# Altium schematic sheet CONNECTOR_INTERFACE.SchDoc
size 420 x 297 mm; SheetNumber: 5; SheetTotal: 23
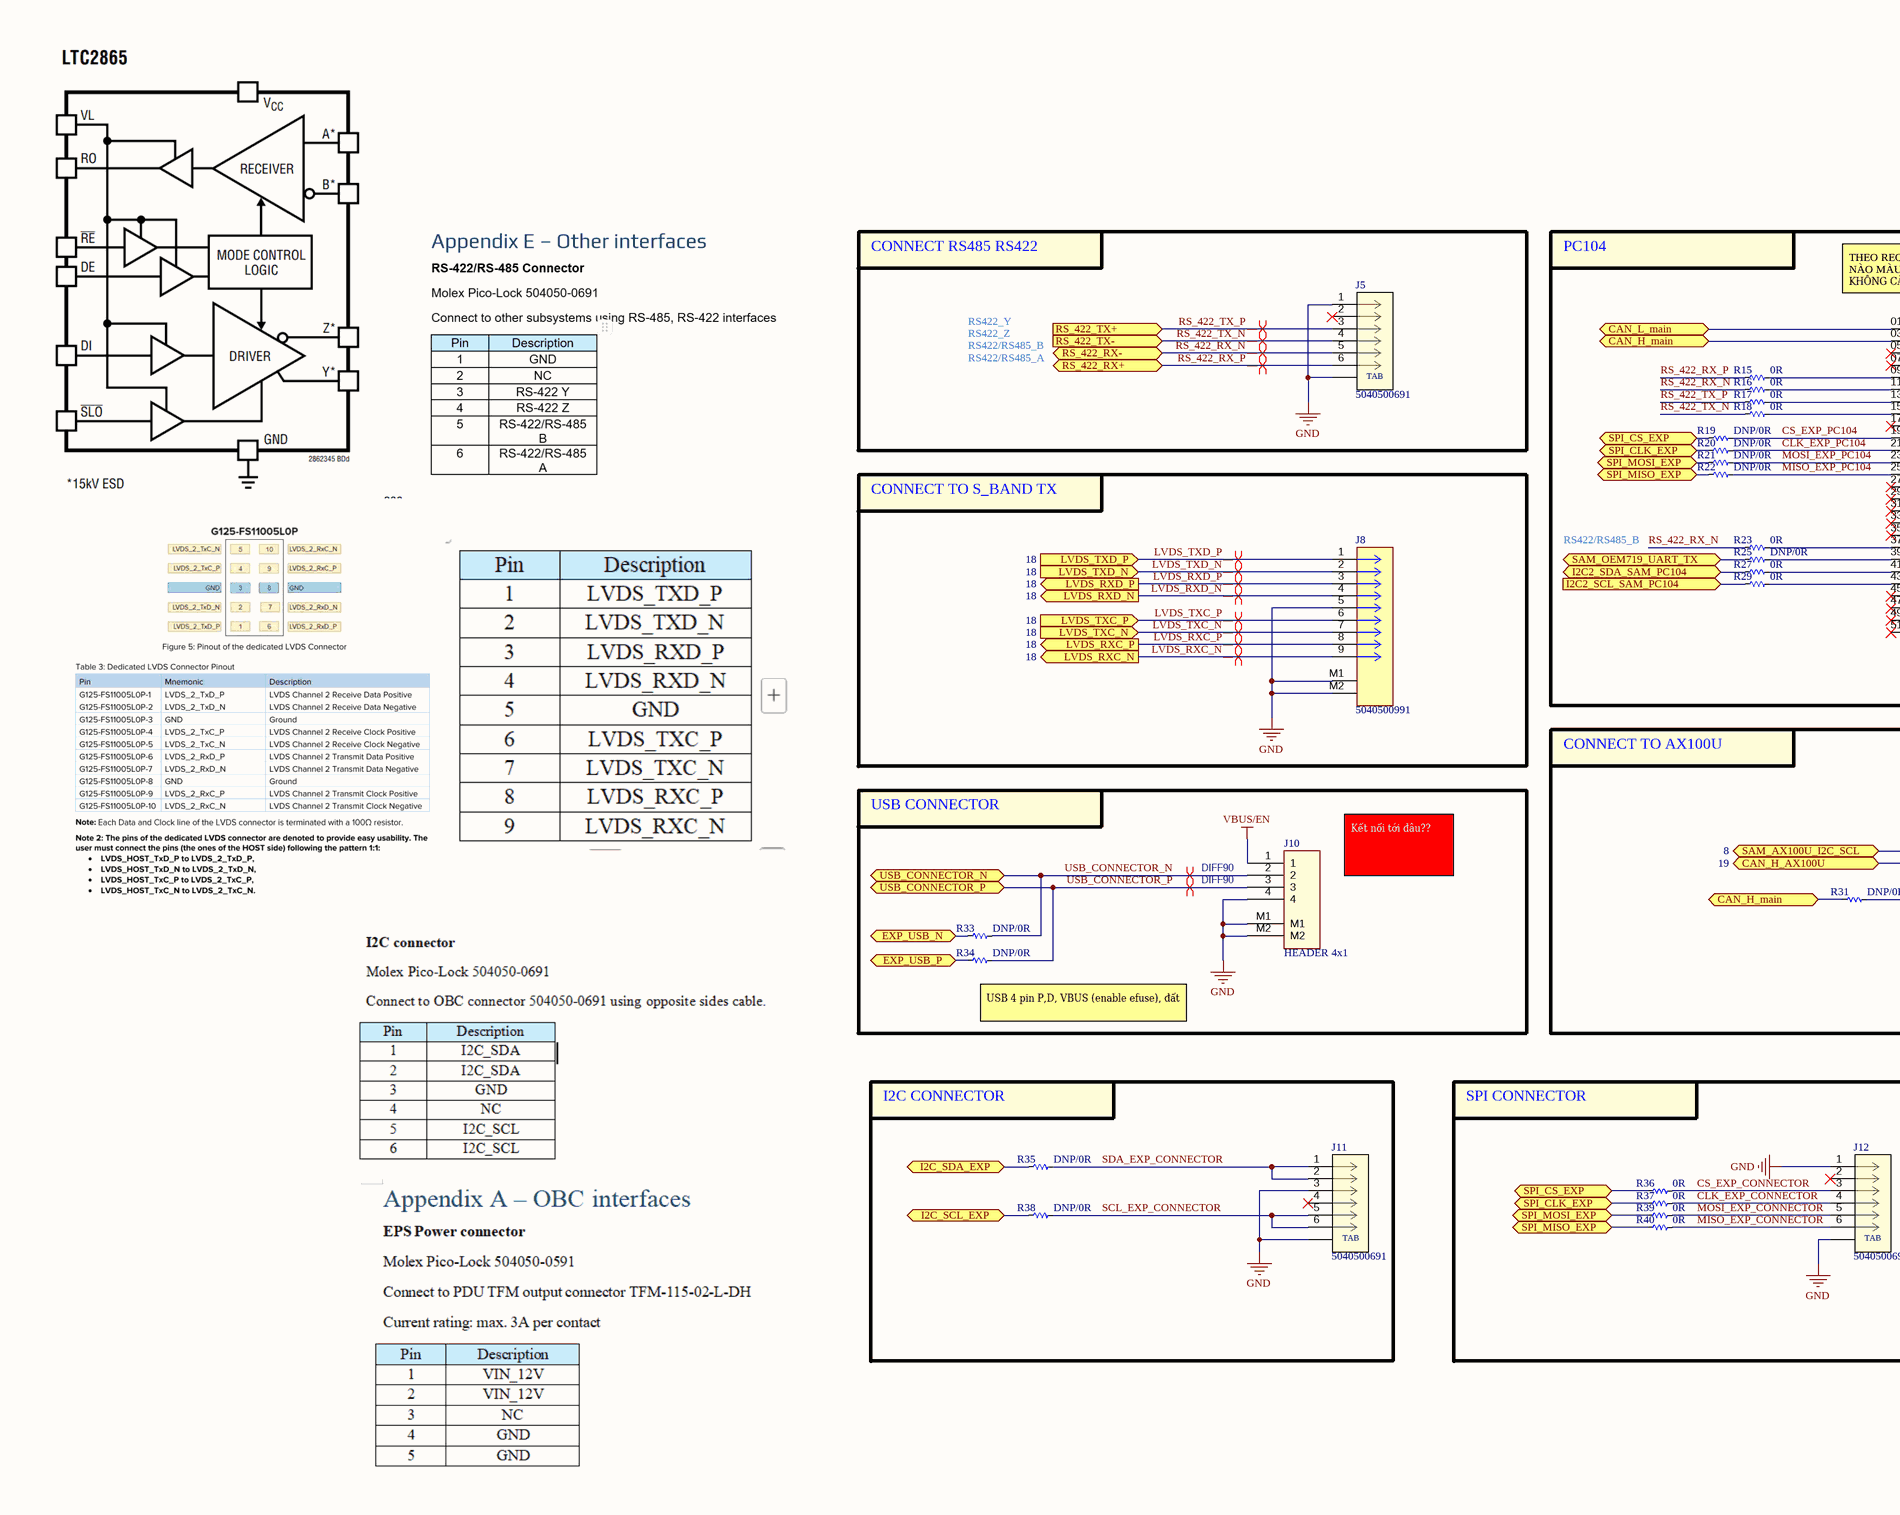
[diagram p0: CONNECTOR_INTERFACE.SchDoc, left]
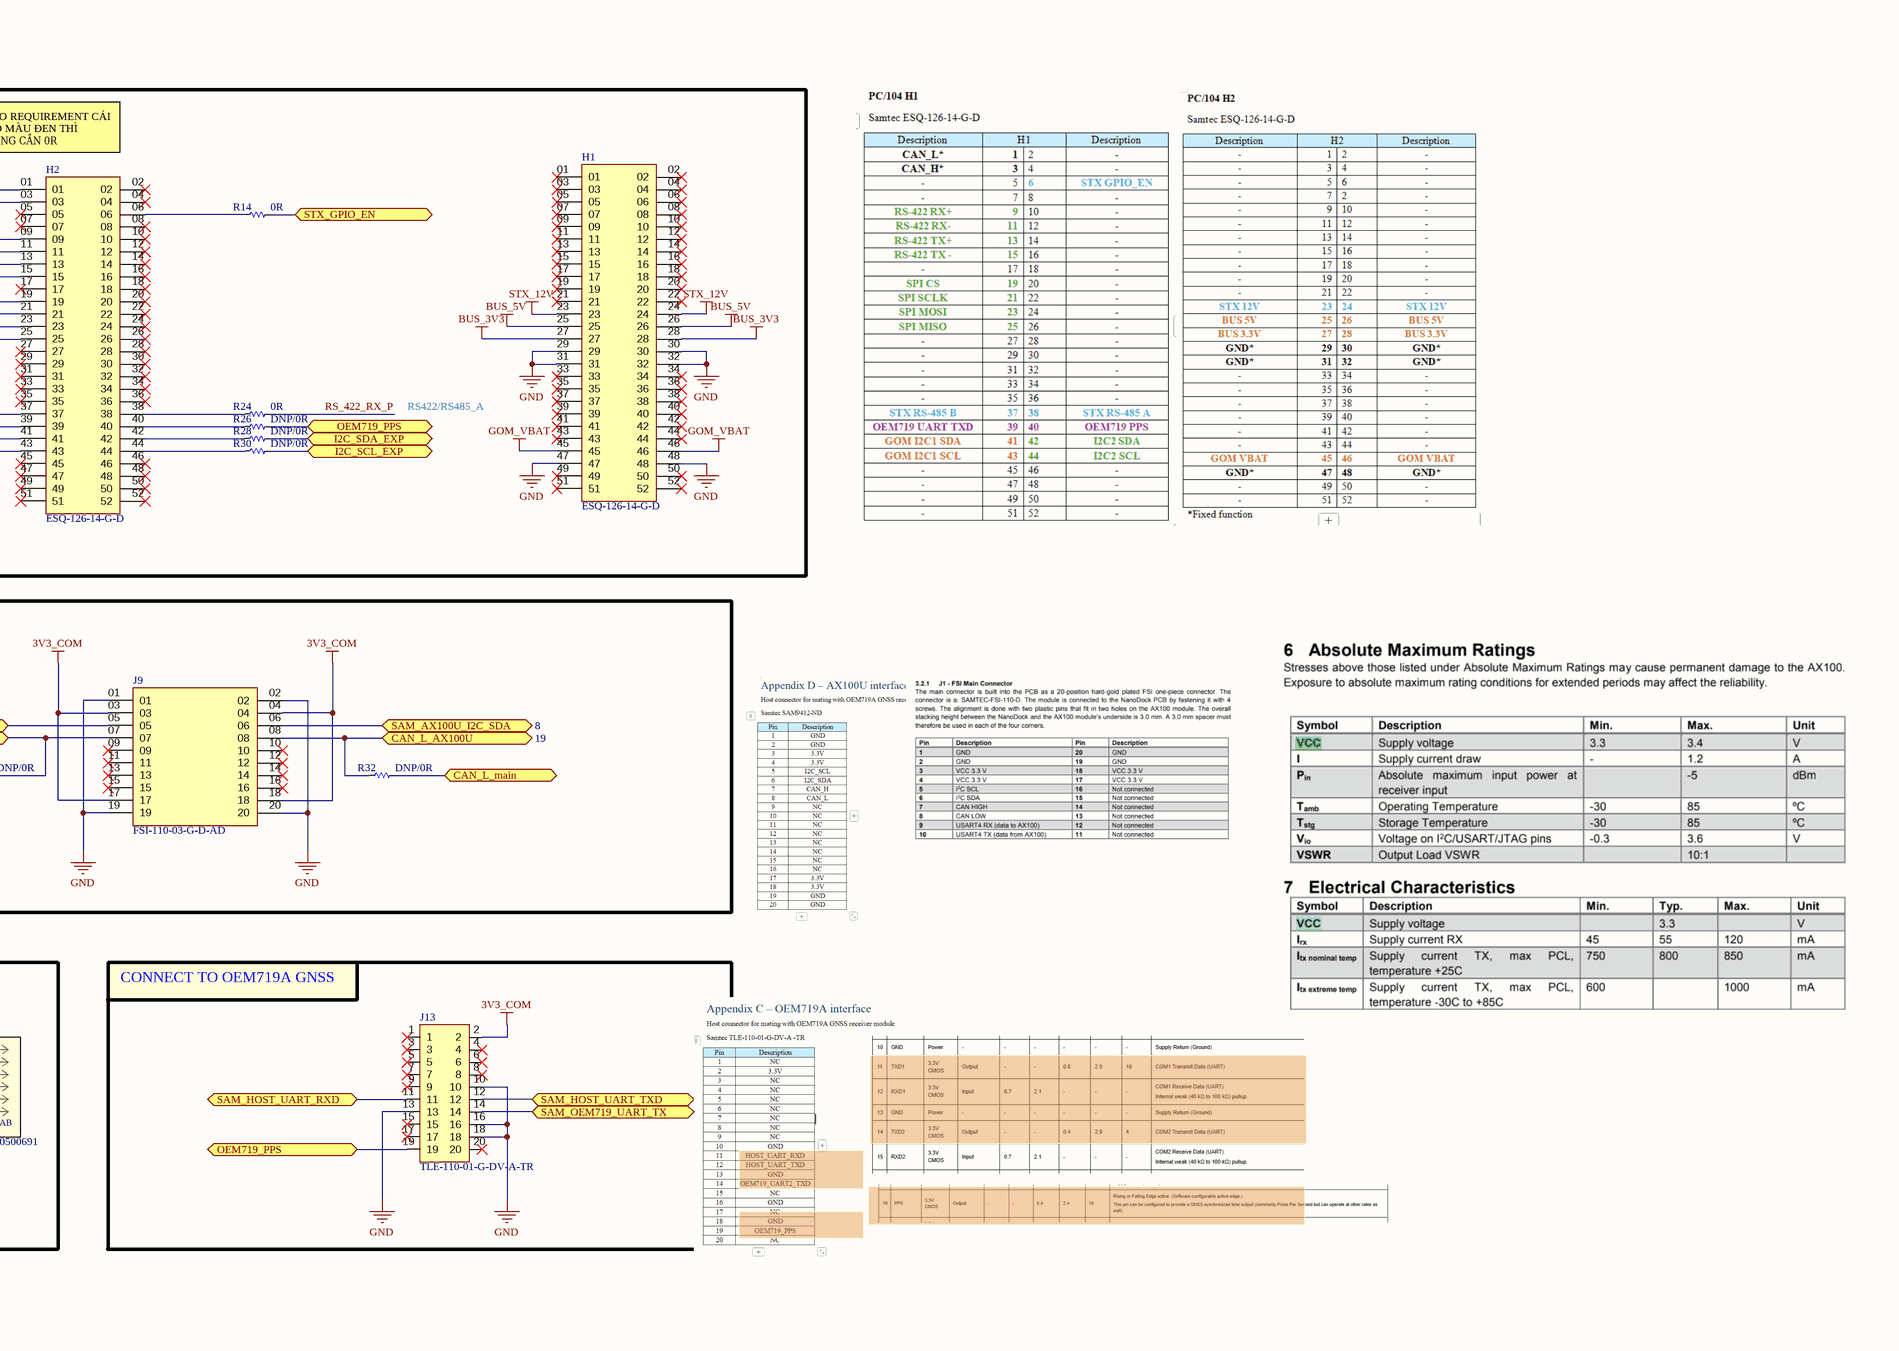
[diagram p1: CONNECTOR_INTERFACE.SchDoc, right]

## Parts
H1  ESQ-126-14-G-D  [SAMTEC_ESQ-126-14-G-D]
H2  ESQ-126-14-G-D  [SAMTEC_ESQ-126-14-G-D]
J5  5040500691  [5040500691]
J8  5040500991  [5040500991]
J9  FSI-110-03-G-D-AD  [SAMTEC_FSI-110-03-X-D-AD-TR]
J10  HEADER 4x1  [MOLEX_5040500491]
J11  5040500691  [5040500691]
J12  5040500691  [5040500691]
J13  TLE-110-01-G-DV-A-TR  [SAMTEC-TLE-110-01-X-DV-A]
R14  0R  [RES_C_1005x30_L]
R15  0R  [RES_C_1005x30_L]
R16  0R  [RES_C_1005x30_L]
R17  0R  [RES_C_1005x30_L]
R18  0R  [RES_C_1005x30_L]
R19  DNP/0R  [RES_C_1005x30_L]
R20  DNP/0R  [RES_C_1005x30_L]
R21  DNP/0R  [RES_C_1005x30_L]
R22  DNP/0R  [RES_C_1005x30_L]
R23  0R  [RES_C_1005x30_L]
R24  0R  [RES_C_1005x30_L]
R25  DNP/0R  [RES_C_1005x30_L]
R26  DNP/0R  [RES_C_1005x30_L]
R27  0R  [RES_C_1005x30_L]
R28  DNP/0R  [RES_C_1005x30_L]
R29  0R  [RES_C_1005x30_L]
R30  DNP/0R  [RES_C_1005x30_L]
R31  DNP/0R  [RES_C_1005x30_L]
R32  DNP/0R  [RES_C_1005x30_L]
R33  DNP/0R  [RES_C_1005x30_L]
R34  DNP/0R  [RES_C_1005x30_L]
R35  DNP/0R  [RES_C_1005x30_L]
R36  0R  [RES_C_1005x30_L]
R37  0R  [RES_C_1005x30_L]
R38  DNP/0R  [RES_C_1005x30_L]
R39  0R  [RES_C_1005x30_L]
R40  0R  [RES_C_1005x30_L]

## Blocks framed on the sheet
CONNECT RS485 RS422: J5
PC104: H1 H2 R14-R30
CONNECT TO S_BAND TX: J8
CONNECT TO AX100U: J9 R31 R32
USB CONNECTOR: J10 R33 R34
I2C CONNECTOR: J11 R35 R38
SPI CONNECTOR: J12 R36 R37 R39 R40
CONNECT TO OEM719A GNSS: J13

## Ports
CAN_H_AX100U (bidir, see 19), CAN_H_main (bidir, see 4, 5, 19), CAN_L_AX100U (bidir, see 19), CAN_L_main (bidir, see 4, 5, 19), EXP_USB_N (bidir, see 4, 7), EXP_USB_P (bidir, see 4, 7), I2C2_SCL_SAM_PC104 (in, see 8), I2C2_SDA_SAM_PC104 (bidir, see 8), I2C_SCL_EXP (bidir, see 4, 5, 8), I2C_SDA_EXP (bidir, see 4, 5, 8), LVDS_RXC_N (out, see 18), LVDS_RXC_P (out, see 18), LVDS_RXD_N (out, see 18), LVDS_RXD_P (out, see 18), LVDS_TXC_N (in, see 18), LVDS_TXC_P (in, see 18), LVDS_TXD_N (in, see 18), LVDS_TXD_P (in, see 18), OEM719_PPS (bidir, see 5, 8), RS_422_RX+ (bidir, see 21), RS_422_RX- (bidir, see 21), RS_422_TX+ (in, see 21), RS_422_TX- (in, see 21), SAM_AX100U_I2C_SCL (bidir, see 8), SAM_AX100U_I2C_SDA (bidir, see 8), SAM_HOST_UART_RXD (bidir, see 8), SAM_HOST_UART_TXD (bidir, see 8), SAM_OEM719_UART_TX (bidir, see 5, 8), SPI_CLK_EXP (bidir, see 4, 5), SPI_CS_EXP (bidir, see 4, 5), SPI_MISO_EXP (bidir, see 4, 5), SPI_MOSI_EXP (bidir, see 4, 5), STX_GPIO_EN (bidir, see 8), USB_CONNECTOR_N (bidir, see 13), USB_CONNECTOR_P (bidir, see 13)

## Nets
3V3_COM: J9.03 J9.04 J9.17 J9.18 J13.2
BUS_3V3: H1.27 H1.28
BUS_5V: H1.25 H1.26
GND: H1.29 H1.30 H1.31 H1.32 H1.47 H1.48 J5.1 J5.7 J8.5 J8.M1 J8.M2 J9.01 J9.02 J9.19 J9.20 J10.4 J10.M1 J10.M2 J11.3 J11.7 J12.1 J12.7 J13.10 J13.13 J13.16 J13.18
GOM_VBAT: H1.45 H1.46
STX_12V: H1.23 H1.24
VBUS/EN: J10.1
CAN_H_AX100U: J9.07 R31.2 ; port CAN_H_AX100U
CAN_H_main: H2.03 R31.1 ; port CAN_H_main
CAN_L_AX100U: J9.08 R32.1 ; port CAN_L_AX100U
CAN_L_main: H2.01 R32.2 ; port CAN_L_main
CLK_EXP_CONNECTOR: J12.4 R37.2
CLK_EXP_PC104: H2.21 R20.2
CS_EXP_CONNECTOR: J12.3 R36.2
CS_EXP_PC104: H2.19 R19.2
EXP_USB_N: R33.1 ; port EXP_USB_N
EXP_USB_P: R34.1 ; port EXP_USB_P
I2C2_SCL_SAM_PC104: R29.1 ; port I2C2_SCL_SAM_PC104
I2C2_SDA_SAM_PC104: R27.1 ; port I2C2_SDA_SAM_PC104
I2C_SCL_EXP: R30.2 R38.1 ; port I2C_SCL_EXP
I2C_SDA_EXP: R28.2 R35.1 ; port I2C_SDA_EXP
LVDS_RXC_N: J8.9 ; port LVDS_RXC_N
LVDS_RXC_P: J8.8 ; port LVDS_RXC_P
LVDS_RXD_N: J8.4 ; port LVDS_RXD_N
LVDS_RXD_P: J8.3 ; port LVDS_RXD_P
LVDS_TXC_N: J8.7 ; port LVDS_TXC_N
LVDS_TXC_P: J8.6 ; port LVDS_TXC_P
LVDS_TXD_N: J8.2 ; port LVDS_TXD_N
LVDS_TXD_P: J8.1 ; port LVDS_TXD_P
MISO_EXP_CONNECTOR: J12.6 R40.2
MISO_EXP_PC104: H2.25 R22.2
MOSI_EXP_CONNECTOR: J12.5 R39.2
MOSI_EXP_PC104: H2.23 R21.2
OEM719_PPS: J13.19 R26.2 ; port OEM719_PPS
RS_422_RX_N: J5.5 R16.1 R23.1 ; port RS_422_RX-
RS_422_RX_P: J5.6 R15.1 R24.2 ; port RS_422_RX+
RS_422_TX_N: J5.4 R18.1 ; port RS_422_TX-
RS_422_TX_P: J5.3 R17.1 ; port RS_422_TX+
SAM_AX100U_I2C_SCL: J9.05 ; port SAM_AX100U_I2C_SCL
SAM_AX100U_I2C_SDA: J9.06 ; port SAM_AX100U_I2C_SDA
SAM_HOST_UART_RXD: J13.11 ; port SAM_HOST_UART_RXD
SAM_HOST_UART_TXD: J13.12 ; port SAM_HOST_UART_TXD
SAM_OEM719_UART_TX: J13.14 R25.1 ; port SAM_OEM719_UART_TX
SCL_EXP_CONNECTOR: J11.5 J11.6 R38.2
SDA_EXP_CONNECTOR: J11.1 J11.2 R35.2
SPI_CLK_EXP: R20.1 R37.1 ; port SPI_CLK_EXP
SPI_CS_EXP: R19.1 R36.1 ; port SPI_CS_EXP
SPI_MISO_EXP: R22.1 R40.1 ; port SPI_MISO_EXP
SPI_MOSI_EXP: R21.1 R39.1 ; port SPI_MOSI_EXP
STX_GPIO_EN: R14.2 ; port STX_GPIO_EN
USB_CONNECTOR_N: J10.2 R33.2 ; port USB_CONNECTOR_N
USB_CONNECTOR_P: J10.3 R34.2 ; port USB_CONNECTOR_P
NetH2_06: H2.06 R14.1
NetH2_09: H2.09 R15.2
NetH2_11: H2.11 R16.2
NetH2_13: H2.13 R17.2
NetH2_15: H2.15 R18.2
NetH2_37: H2.37 R23.2
NetH2_38: H2.38 R24.1
NetH2_39: H2.39 R25.2
NetH2_40: H2.40 R26.1
NetH2_41: H2.41 R27.2
NetH2_42: H2.42 R28.1
NetH2_43: H2.43 R29.2
NetH2_44: H2.44 R30.1

Not connected (* = marked no-connect by the designer): H1 01* 02* 03* 04* 05* 06* 07* 08* 09* 10* 11* 12* 13* 14* 15* 16* 17* 18* 19* 20* 21* 22* 33* 34* 35* 36* 37* 38* 39* 40* 41* 42* 43* 44* 49* 50* 51* 52*; H2 02* 04* 05* 07* 08* 10* 12* 14* 16* 17* 18* 20* 22* 24* 26* 27* 28* 29* 30* 31* 32* 33* 34* 35* 36* 45* 46* 47* 48* 49* 50* 51* 52*; J5 2*; J9 09* 10* 11* 12* 13* 14* 15* 16*; J11 4*; J12 2*; J13 1* 3* 4* 5* 6* 7* 8* 9* 15* 17* 20*

## Layout directives
differential pair: LVDS_RXC_N, LVDS_RXC_P, LVDS_RXD_N, LVDS_RXD_P, LVDS_TXC_N, LVDS_TXC_P, LVDS_TXD_N, LVDS_TXD_P, RS_422_RX_N, RS_422_RX_P, RS_422_TX_N, RS_422_TX_P
differential pair; differential pair class DIFF90; net class DIFF90; rule Matched Net Lengths [Tolerance = 4mil]: USB_CONNECTOR_N, USB_CONNECTOR_P

## Notes on the sheet
- RS422_Z
- RS422_Y
- (near H2) THEO REQUIREMENT CÁI NÀO MÀU ĐEN THÌ KHÔNG CẦN 0R
- RS422/RS485_A
- RS422/RS485_B
- Kết nối tới đâu??
- (near R34) USB 4 pin P,D, VBUS (enable efuse), đất
- Project:
- BEE-1012
- Sub-system:
- SATELLITE_EXP_CONTROLLER
- Design by:
- SANG HUYNH
- BAO BUI
- Sheet title:
- Sheet
- A3
- of
- Checked by:
- Approved by:
- VU PHAM
- Revision:
- Document No:
- Size:
- Date:
- (in symbol 5040500691) TAB

## Library data of the parts
H1 H2 = ESQ-126-14-G-D: CONN SOCKET 52POS 0.1 GOLD PCB; MF: Samtec; MP: ESQ-126-14-G-D; Price: None; Package: None; Value: *; Availability: Unavailable
J5 J11 J12 = 5040500691: 1.50mm Pitch, Pico-Lock PCB Header, Single Row, Right-Angle, Surface Mount, Gold (Au) Plating, Positive Lock, 6 Circuits, Tape and Reel; Manufacturer_Name: Molex Connector Corporation; Copyright: Copyright (C) 2025 Ultra Librarian. All rights reserved.; Manufacturer_Part_Number: 5040500691; Datasheet: https://www.molex.com/en-us/products/part-detail-pdf/5040500691?display=pdf; RefDes: RefDes; Type: Type
J8 = 5040500991: Connector Header Surface Mount, Right Angle 9 position 0.059" (1.50mm)
J9 = FSI-110-03-X-D-AD-TR: CONN STACKING 20POS SMD GOLD; Price: None; Value: *; Package: None; MP: FSI-110-03-X-D-AD-TR; Availability: Unavailable
J10 = Header 4x1_2M
J13 = SAMTEC-TLE-110-01-X-DV-A: CONN RCPT 20POS 0.079 GOLD SMD; Availability: Unavailable; MP: SAMTEC-TLE-110-01-X-DV-A; Price: None; Value: *; Package: None
R14-R40 = _RES_B_2: RES